# EAGLE schematic switch (EAGLE 7.6.0)
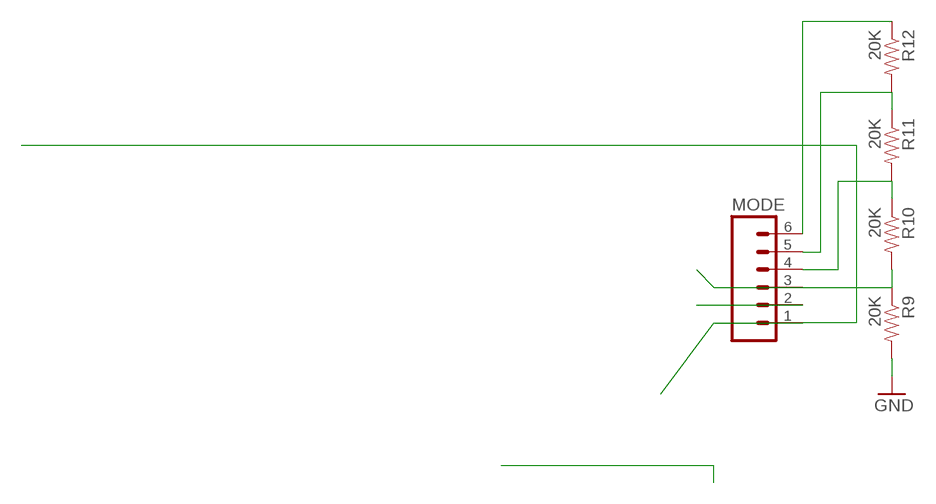
[diagram p0: schematic, sheet 1]

## Parts
MODE  M06SILK_FEMALE_PTH  [1X06]
R9  20K  RESISTORAXIAL-0.3  [AXIAL-0.3]
R10  20K  RESISTORAXIAL-0.3  [AXIAL-0.3]
R11  20K  RESISTORAXIAL-0.3  [AXIAL-0.3]
R12  20K  RESISTORAXIAL-0.3  [AXIAL-0.3]

## Nets
GND: MODE.2 R9.P$2
N$13: MODE.3 R9.P$1 R10.P$2
N$19: MODE.6 R12.P$1
N$20: MODE.5 R11.P$1 R12.P$2
N$21: MODE.4 R10.P$1 R11.P$2
V_5V: MODE.1

## Library data of the parts
MODE = SparkFun-Connectors:M06: Header 6 Standard 6-pin 0.1" header. Use with straight break away headers (SKU : PRT-00116), right angle break away headers (PRT-00553), swiss pins (PRT-00743), machine pins (PRT-00117), and female headers (PRT-00115). Molex polarized connector foot print use with SKU : PRT-08094 with associated crimp pins and housings. NOTES ON THE VARIANTS LOCK and LOCK_LONGPADS... This footprint was designed to help hold the alignment of a through-hole component (i.e. 6-pin header) while soldering it into place. You may notice that each hole has been shifted either up or down by 0.005 of an inch from it's more standard position (which is a perfectly straight line). This slight alteration caused the pins (the squares in the middle) to touch the edges of the holes. Because they are alternating, it causes a "brace" to hold the component in place. 0.005 has proven to be the perfect amount of "off-center" position when using our standard breakaway headers. Although looks a little odd when you look at the bare footprint, once you have a header in there, the alteration is very hard to notice. Also,if you push a header all the way into place, it is covered up entirely on the bottom side. This idea of altering the position of holes to aid alignment will be further integrated into the Sparkfun Library for other footprints. It can help hold any component with 3 or more connection pins.; PROD_ID: CONN-08437
R9-R12 = SparkFun-Passives:RESISTOR: Resistor Basic schematic elements and footprints for 0603, 1206, and PTH resistors.

## Net classes
0 default: width 0.254 mm